# Altium schematic sheet esp32.SchDoc
size A; SheetNumber: 3; SheetTotal: 2
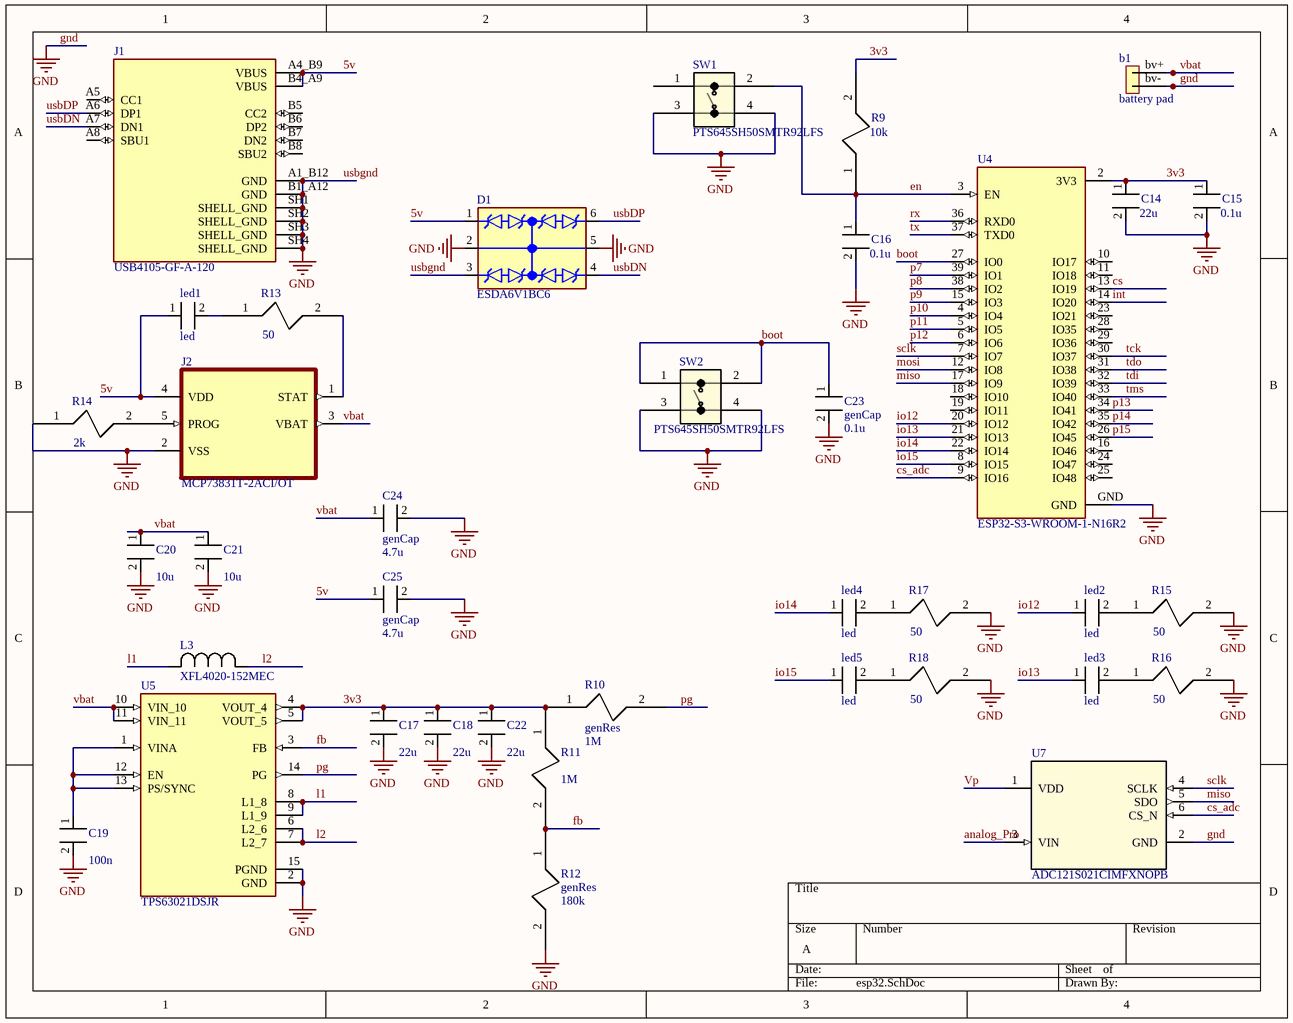
[diagram p0: esp32.SchDoc]

## Parts
b1  battery pad  [bat_pads]
C14  C: 22u  [GeneralCap]  (hidden comment: genCap)
C15  C: 0.1u  [GeneralCap]  (hidden comment: genCap)
C16  C: 0.1u  [GeneralCap]  (hidden comment: genCap)
C17  C: 22u  [GeneralCap]  (hidden comment: genCap)
C18  C: 22u  [GeneralCap]  (hidden comment: genCap)
C19  C: 100n  [GeneralCap]  (hidden comment: genCap)
C20  C: 10u  [GeneralCap]  (hidden comment: genCap)
C21  C: 10u  [GeneralCap]  (hidden comment: genCap)
C22  C: 22u  [GeneralCap]  (hidden comment: genCap)
C23  genCap  C: 0.1u  [GeneralCap]
C24  genCap  C: 4.7u  [GeneralCap]
C25  genCap  C: 4.7u  [GeneralCap]
D1  ESDA6V1BC6  [SOT95P280X145-6N]
J1  USB4105-GF-A-120  [GCT_USB4105-GF-A-120]
J2  MCP73831T-2ACI/OT  [SOT95P280X145-5N]
L3  XFL4020-152MEC  [IND_XFL4020_COC]
led1  led  [GeneralCap]
led2  led  [GeneralCap]
led3  led  [GeneralCap]
led4  led  [GeneralCap]
led5  led  [GeneralCap]
R9  R: 10k  [GeneralCap]  (hidden comment: genRes)
R10  genRes  R: 1M  [GeneralCap]
R11  R: 1M  [GeneralCap]  (hidden comment: genRes)
R12  genRes  R: 180k  [GeneralCap]
R13  R: 50  [GeneralCap]  (hidden comment: genRes)
R14  R: 2k  [GeneralCap]  (hidden comment: genRes)
R15  R: 50  [GeneralCap]  (hidden comment: genRes)
R16  R: 50  [GeneralCap]  (hidden comment: genRes)
R17  R: 50  [GeneralCap]  (hidden comment: genRes)
R18  R: 50  [GeneralCap]  (hidden comment: genRes)
SW1  PTS645SH50SMTR92LFS  [PTS645S_SMTR92_CNK]
SW2  PTS645SH50SMTR92LFS  [PTS645S_SMTR92_CNK]
U4  ESP32-S3-WROOM-1-N16R2  [XCVR_ESP32-S3-WROOM-1-N16R2]
U5  TPS63021DSJR  [IC_TPS63021DSJR]
U7  ADC121S021CIMFXNOPB  [DBV0006A_N]

## Nets
gnd: b1.bv- C14.2 C15.2 C16.2 C17.2 C18.2 C19.2 C20.2 C21.2 C22.2 C23.2 C24.2 C25.2 D1.2(CC1) D1.3(C2) D1.5(CC2) J1.A1_B12(GND) J1.B1_A12(GND) J1.SH1(SHELL_GND) J1.SH2(SHELL_GND) J1.SH3(SHELL_GND) J1.SH4(SHELL_GND) J2.2(VSS) R12.2 R14.1 R15.2 R16.2 R17.2 R18.2 SW1.3 SW1.4 SW2.3 SW2.4 U4.GND U5.2(GND) U5.15(PGND) U7.2(GND)  [also labelled usbgnd]
3v3: C14.1 C15.1 C17.1 C18.1 C22.1 R9.2 R10.1 R11.1 U4.2(3V3) U5.4(VOUT_4) U5.5(VOUT_5)
5v: C25.1 D1.1(C1) J1.A4_B9(VBUS) J1.B4_A9(VBUS) J2.4(VDD) led1.1
analog_Pro: U7.3(VIN)
boot: C23.1 SW2.1 SW2.2 U4.27(IO0)
cs: U4.13(IO19)
cs_adc: U4.9(IO16) U7.6(CS_N)
en: C16.1 R9.1 SW1.2 U4.3(EN)
fb: R11.2 R12.1 U5.3(FB)
int: U4.14(IO20)
io12: led2.1 U4.20(IO12)
io13: led3.1 U4.21(IO13)
io14: led4.1 U4.22(IO14)
io15: led5.1 U4.8(IO15)
l1: L3.2 U5.8(L1_8) U5.9(L1_9)
l2: L3.1 U5.6(L2_6) U5.7(L2_7)
miso: U4.17(IO9) U7.5(SDO)
mosi: U4.12(IO8)
p7: U4.39(IO1)
p8: U4.38(IO2)
p9: U4.15(IO3)
p10: U4.4(IO4)
p11: U4.5(IO5)
p12: U4.6(IO6)
p13: U4.34(IO41)
p14: U4.35(IO42)
p15: U4.26(IO45)
pg: R10.2 U5.14(PG)
rx: U4.36(RXD0)
sclk: U4.7(IO7) U7.4(SCLK)
tck: U4.30(IO37)
tdi: U4.32(IO39)
tdo: U4.31(IO38)
tms: U4.33(IO40)
tx: U4.37(TXD0)
usbDN: D1.4(C3) J1.A7(DN1)
usbDP: D1.6(C4) J1.A6(DP1)
vbat: b1.bv+ C20.1 C21.1 C24.1 J2.3(VBAT) U5.10(VIN_10) U5.11(VIN_11)
Vp: U7.1(VDD)
NetC19_1: C19.1 U5.1(VINA) U5.12(EN) U5.13(PS/SYNC)
NetJ2_1: J2.1(STAT) R13.2
NetJ2_5: J2.5(PROG) R14.2
Netled1_2: led1.2 R13.1
Netled2_2: led2.2 R15.1
Netled3_2: led3.2 R16.1
Netled4_2: led4.2 R17.1
Netled5_2: led5.2 R18.1

Not connected (* = marked no-connect by the designer): J1 A5(CC1) A8(SBU1) B5(CC2) B6(DP2) B7(DN2) B8(SBU2); SW1 1; U4 10(IO17) 11(IO18) 16(IO46) 18(IO10) 19(IO11) 23(IO21) 24(IO47) 25(IO48) 28(IO35) 29(IO36)

## Library data of the parts
C14 C17 C18 C22 = genCap: C86295
C15 C16 C19 C23 = genCap: C14663
C20 C21 = genCap: C6119842
C24 C25 = genCap: C19666
D1 = ESDA6V1BC6: C495220; MF: STMicroelectronics; Check_prices: https://www.snapeda.com/parts/ESDA6V1BC6/STMicroelectronics/view-part/?ref=eda; Price: None; MP: ESDA6V1BC6; Purchase-URL: https://pricing.snapeda.com/search/part/ESDA6V1BC6/?ref=eda; SnapEDA_Link: https://www.snapeda.com/parts/ESDA6V1BC6/STMicroelectronics/view-part/?ref=snap; Availability: In Stock; Package: SOT-23-6 STMicroelectronics; Value: *
J1 = USB4105-GF-A-120: MF: Global Connector Technology; MP: USB4105GFA120; SnapEDA_Link: https://www.snapeda.com/parts/USB4105GFA120/Global+Connector+Technology/view-part/?ref=snap; Package: None; Value: *; Check_prices: https://www.snapeda.com/parts/USB4105GFA120/Global+Connector+Technology/view-part/?ref=eda
J2 = MCP73831T-2ACI/OT: C424093; MF: Microchip; Package: SOT-23 Microchip; Purchase-URL: https://pricing.snapeda.com/search/part/MCP73831T-2ACI/OT/?ref=eda; MP: MCP73831T-2ACI/OT; Value: *; Availability: In Stock; SnapEDA_Link: https://www.snapeda.com/parts/MCP73831T-2ACI/OT/Microchip/view-part/?ref=snap; Price: None; Check_prices: https://www.snapeda.com/parts/MCP73831T-2ACI/OT/Microchip/view-part/?ref=eda
L3 = XFL4020-152MEC: C3033018; Mfr_Name: Coilcraft; Type: Fixed Inductors
led1-led5 = genCap: C965799; C: ?
R9 = genRes: C98220
R10 R11 = genRes: C105578
R12 = genRes: C123419
R13 R15-R18 = genRes: C844932
R14 = genRes: C22975
SW1 SW2 = PTS645SH50SMTR92LFS: C221869; Mfr_Name: C&K Components; Type: Tactile Switches; RefDes: RefDes
U4 = ESP32-S3-WROOM-1-N16R2: C2913205; MF: Espressif Systems; MP: ESP32S3WROOM1N16R2; SnapEDA_Link: https://www.snapeda.com/parts/ESP32S3WROOM1N16R2/Espressif+Systems/view-part/?ref=snap; Package: NON STANDARD Espressif Systems; Value: *; Check_prices: https://www.snapeda.com/parts/ESP32S3WROOM1N16R2/Espressif+Systems/view-part/?ref=eda
U7 = ADC121S021CIMFXNOPB: C701596; Mfr_Name: Texas Instruments; TYPE: TYPE; RefDes: RefDes
U5 = TPS63021DSJR: Price: None; MP: TPS63021DSJR; Value: *; Availability: Unavailable; Package: None